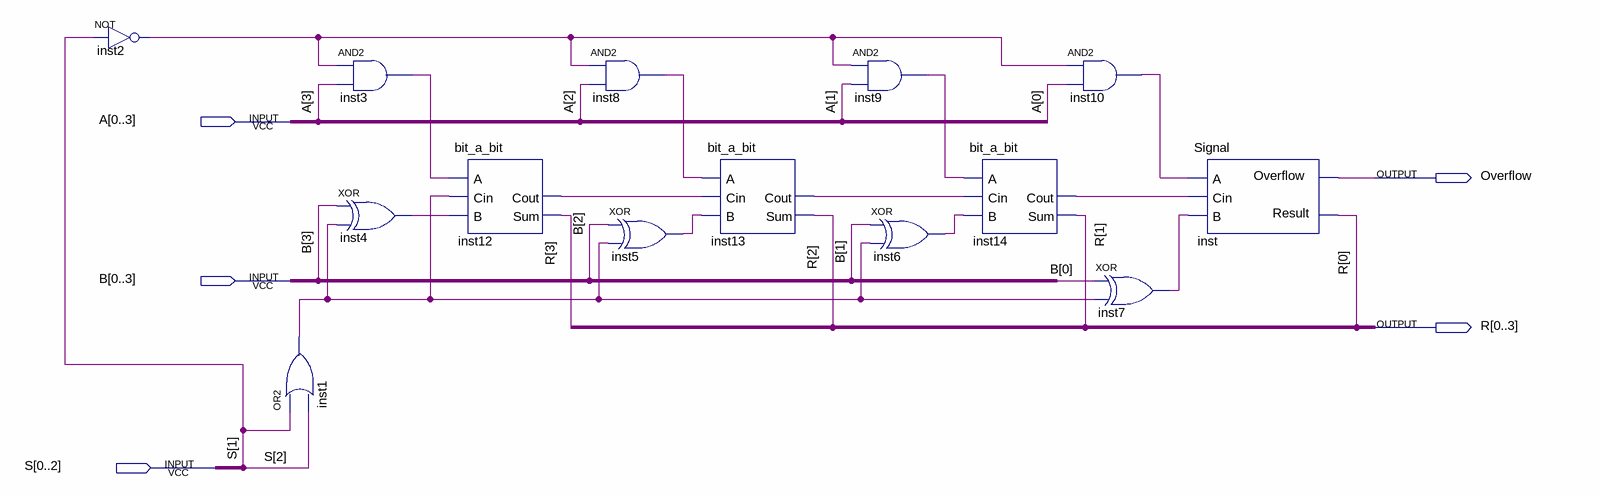
[diagram p0: schematic sheet]
// Quartus schematic FullAdder4bitSigned.bdf as structural Verilog: 14 symbols, 5 pins
module FullAdder4bitSigned (
  input  [0:3] A,
  input  [0:3] B,
  input  [0:2] S,
  output Overflow,
  output [0:3] R
);

  wire inst1_out, inst2_out, inst3_out, inst4_out, inst5_out, inst6_out, inst7_out, inst8_out, inst9_out,
       inst10_out, inst12_cout, inst13_cout, inst14_cout;

  not inst2 (inst2_out, S[1]);
  or inst1 (inst1_out, S[1], S[2]);
  and inst3 (inst3_out, inst2_out, A[3]);
  xor inst4 (inst4_out, B[3], inst1_out);
  bit_a_bit inst12 (.A(inst3_out), .B(inst4_out), .Cin(inst1_out), .Sum(R[3]), .Cout(inst12_cout));
  and inst8 (inst8_out, inst2_out, A[2]);
  xor inst5 (inst5_out, B[2], inst1_out);
  bit_a_bit inst13 (.A(inst8_out), .B(inst5_out), .Cin(inst12_cout), .Sum(R[2]), .Cout(inst13_cout));
  and inst9 (inst9_out, inst2_out, A[1]);
  xor inst6 (inst6_out, B[1], inst1_out);
  bit_a_bit inst14 (.A(inst9_out), .B(inst6_out), .Cin(inst13_cout), .Sum(R[1]), .Cout(inst14_cout));
  and inst10 (inst10_out, inst2_out, A[0]);
  xor inst7 (inst7_out, B[0], inst1_out);
  Signal inst (.A(inst10_out), .B(inst7_out), .Cin(inst14_cout), .Result(R[0]), .Overflow(Overflow));
endmodule
